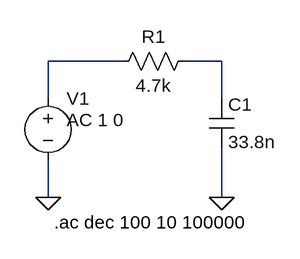
[diagram p0: schematic low_pass_filter.asc]
low_pass_filter.asc, the LTspice schematic file:
Version 4
SHEET 1 880 680
WIRE 144 160 48 160
WIRE 272 160 224 160
WIRE 48 208 48 160
WIRE 272 208 272 160
WIRE 48 336 48 288
WIRE 272 336 272 272
FLAG 272 336 0
FLAG 48 336 0
SYMBOL res 240 144 R90
WINDOW 0 0 56 VBottom 2
WINDOW 3 32 56 VTop 2
SYMATTR InstName R1
SYMATTR Value 4.7k
SYMBOL cap 256 208 R0
SYMATTR InstName C1
SYMATTR Value 33.8n
SYMBOL voltage 48 192 R0
WINDOW 123 24 44 Left 2
WINDOW 39 0 0 Left 0
SYMATTR InstName V1
SYMATTR Value ""
SYMATTR Value2 AC 1 0
TEXT 56 368 Left 2 !.ac dec 100 10 100000

The netlist it stands for:
* low_pass_filter.asc
R1 N002 N001 4.7k
C1 N002 0 33.8n
V1 N001 0 AC 1 0
.ac dec 100 10 100000
.backanno
.end